# EAGLE schematic board-template-1 (EAGLE 7.2.0)
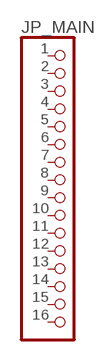
[diagram p0: schematic, sheet 1]

## Parts
JP_MAIN  PINHD-1X16  [1X16]
Unconnected: JP_MAIN.1 JP_MAIN.2 JP_MAIN.3 JP_MAIN.4 JP_MAIN.5 JP_MAIN.6 JP_MAIN.7 JP_MAIN.8 JP_MAIN.9 JP_MAIN.10 JP_MAIN.11 JP_MAIN.12 JP_MAIN.13 JP_MAIN.14 JP_MAIN.15 JP_MAIN.16

## Library data of the parts
JP_MAIN = pinhead:PINHD-1X16: PIN HEADER